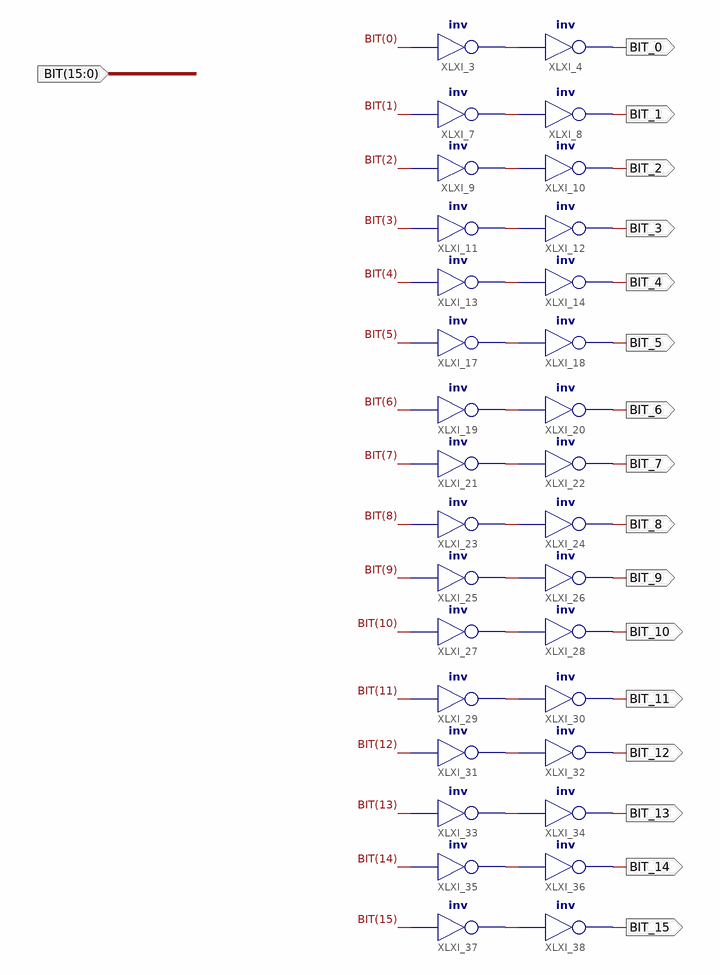
[diagram p0: schematic sheet 1]
// Xilinx ISE schematic Mixbus1_16.sch (spartan6) as structural Verilog: 32 symbols, 17 ports
module Mixbus1_16 (
  input  [15:0] BIT,
  output BIT_15,
  output BIT_14,
  output BIT_13,
  output BIT_12,
  output BIT_11,
  output BIT_10,
  output BIT_9,
  output BIT_8,
  output BIT_7,
  output BIT_6,
  output BIT_5,
  output BIT_4,
  output BIT_3,
  output BIT_2,
  output BIT_1,
  output BIT_0
);

  wire XLXN_12, XLXN_15, XLXN_16, XLXN_17, XLXN_18, XLXN_20, XLXN_21, XLXN_22, XLXN_23, XLXN_24, XLXN_25,
       XLXN_26, XLXN_27, XLXN_28, XLXN_29, XLXN_30;

  not XLXI_3 (XLXN_12, BIT[0]);
  not XLXI_4 (BIT_0, XLXN_12);
  not XLXI_7 (XLXN_15, BIT[1]);
  not XLXI_8 (BIT_1, XLXN_15);
  not XLXI_9 (XLXN_16, BIT[2]);
  not XLXI_10 (BIT_2, XLXN_16);
  not XLXI_11 (XLXN_17, BIT[3]);
  not XLXI_12 (BIT_3, XLXN_17);
  not XLXI_13 (XLXN_18, BIT[4]);
  not XLXI_14 (BIT_4, XLXN_18);
  not XLXI_17 (XLXN_20, BIT[5]);
  not XLXI_18 (BIT_5, XLXN_20);
  not XLXI_19 (XLXN_21, BIT[6]);
  not XLXI_20 (BIT_6, XLXN_21);
  not XLXI_21 (XLXN_22, BIT[7]);
  not XLXI_22 (BIT_7, XLXN_22);
  not XLXI_23 (XLXN_23, BIT[8]);
  not XLXI_24 (BIT_8, XLXN_23);
  not XLXI_25 (XLXN_24, BIT[9]);
  not XLXI_26 (BIT_9, XLXN_24);
  not XLXI_27 (XLXN_25, BIT[10]);
  not XLXI_28 (BIT_10, XLXN_25);
  not XLXI_29 (XLXN_26, BIT[11]);
  not XLXI_30 (BIT_11, XLXN_26);
  not XLXI_31 (XLXN_27, BIT[12]);
  not XLXI_32 (BIT_12, XLXN_27);
  not XLXI_33 (XLXN_28, BIT[13]);
  not XLXI_34 (BIT_13, XLXN_28);
  not XLXI_35 (XLXN_29, BIT[14]);
  not XLXI_36 (BIT_14, XLXN_29);
  not XLXI_37 (XLXN_30, BIT[15]);
  not XLXI_38 (BIT_15, XLXN_30);
endmodule
